# Altium schematic sheet leddriver.SchDoc: APTOMAT - Power Supply
size A4; Revision: 1.1.1; SheetNumber: 5; SheetTotal: 5; DrawnBy: KJP; ProjectNumber: 4397; PCBRevision: 0071KJP; DocumentSize: A4; PCAName: PCA10040; PCBNumber: 400150; ProjectName: Quark
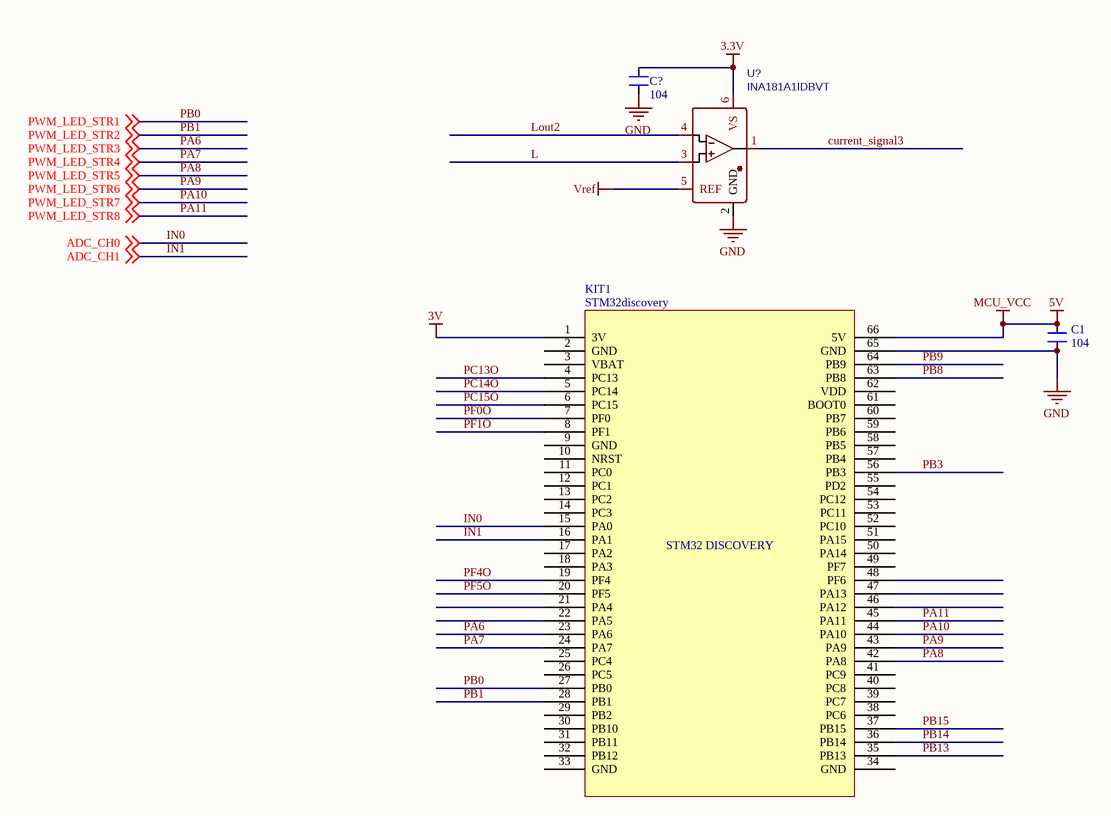
[diagram p0: leddriver.SchDoc]

## Parts
C1  104  [0805_HV]
C?  104  [0805_HV]
KIT1  STM32discovery  [STM32discovery_kit]
U?  INA181A1IDBVT  [SOT95P280X145-6N]

## Nets
3.3V: C?.2 U?.6(VS)
3V: KIT1.1(3V)
5V: C1.2 KIT1.66(5V)  [also labelled MCU_VCC]
GND: C1.1 C?.1 KIT1.65(GND) U?.2(GND)
Vref: U?.5(REF)
current_signal3: U?.1(OUT)
IN0: KIT1.15(PA0) ; off-sheet ADC_CH0  [also labelled ADC_CH0]
IN1: KIT1.16(PA1) ; off-sheet ADC_CH1  [also labelled ADC_CH1]
L: U?.3(IN+)
Lout2: U?.4(IN-)
PA6: KIT1.23(PA6) ; off-sheet PWM_LED_STR3  [also labelled PWM_LED_STR3]
PA7: KIT1.24(PA7) ; off-sheet PWM_LED_STR4  [also labelled PWM_LED_STR4]
PA8: KIT1.42(PA8) ; off-sheet PWM_LED_STR5  [also labelled PWM_LED_STR5]
PA9: KIT1.43(PA9) ; off-sheet PWM_LED_STR6  [also labelled PWM_LED_STR6]
PA10: KIT1.44(PA10) ; off-sheet PWM_LED_STR7  [also labelled PWM_LED_STR7]
PA11: KIT1.45(PA11) ; off-sheet PWM_LED_STR8  [also labelled PWM_LED_STR8]
PB0: KIT1.27(PB0) ; off-sheet PWM_LED_STR1  [also labelled PWM_LED_STR1]
PB1: KIT1.28(PB1) ; off-sheet PWM_LED_STR2  [also labelled PWM_LED_STR2]
PB3: KIT1.56(PB3)
PB8: KIT1.63(PB8)
PB9: KIT1.64(PB9)
PB13: KIT1.35(PB13)
PB14: KIT1.36(PB14)
PB15: KIT1.37(PB15)
PC13O: KIT1.4(PC13)
PC14O: KIT1.5(PC14)
PC15O: KIT1.6(PC15)
PF0O: KIT1.7(PF0)
PF1O: KIT1.8(PF1)
PF4O: KIT1.19(PF4)
PF5O: KIT1.20(PF5)

Not connected (* = marked no-connect by the designer): KIT1 2(GND) 3(VBAT) 9(GND) 10(NRST) 11(PC0) 12(PC1) 13(PC2) 14(PC3) 17(PA2) 18(PA3) 21(PA4) 22(PA5) 25(PC4) 26(PC5) 29(PB2) 30(PB10) 31(PB11) 32(PB12) 33(GND) 34(GND) 38(PC6) 39(PC7) 40(PC8) 41(PC9) 46(PA12) 47(PA13) 48(PF6) 49(PF7) 50(PA14) 51(PA15) 52(PC10) 53(PC11) 54(PC12) 55(PD2) 57(PB4) 58(PB5) 59(PB6) 60(PB7) 61(BOOT0) 62(VDD)

## Notes on the sheet
- (in symbol STM32Discovery_kit) STM32 DISCOVERY

## Library data of the parts
C1 C? = CM: Cap SMD; Value: 103
KIT1 = STM32Discovery_kit
U? = INA181: BOM_Manufacturer: Texas Instruments; BOM_Manufacturer Part: INA181A2IDBVT; Contributor: LCSC; BOM_Supplier: LCSC; BOM_Supplier Part: C116200; spicePre: U